# Altium project HuaweiInverterMODBUS.PrjPcb
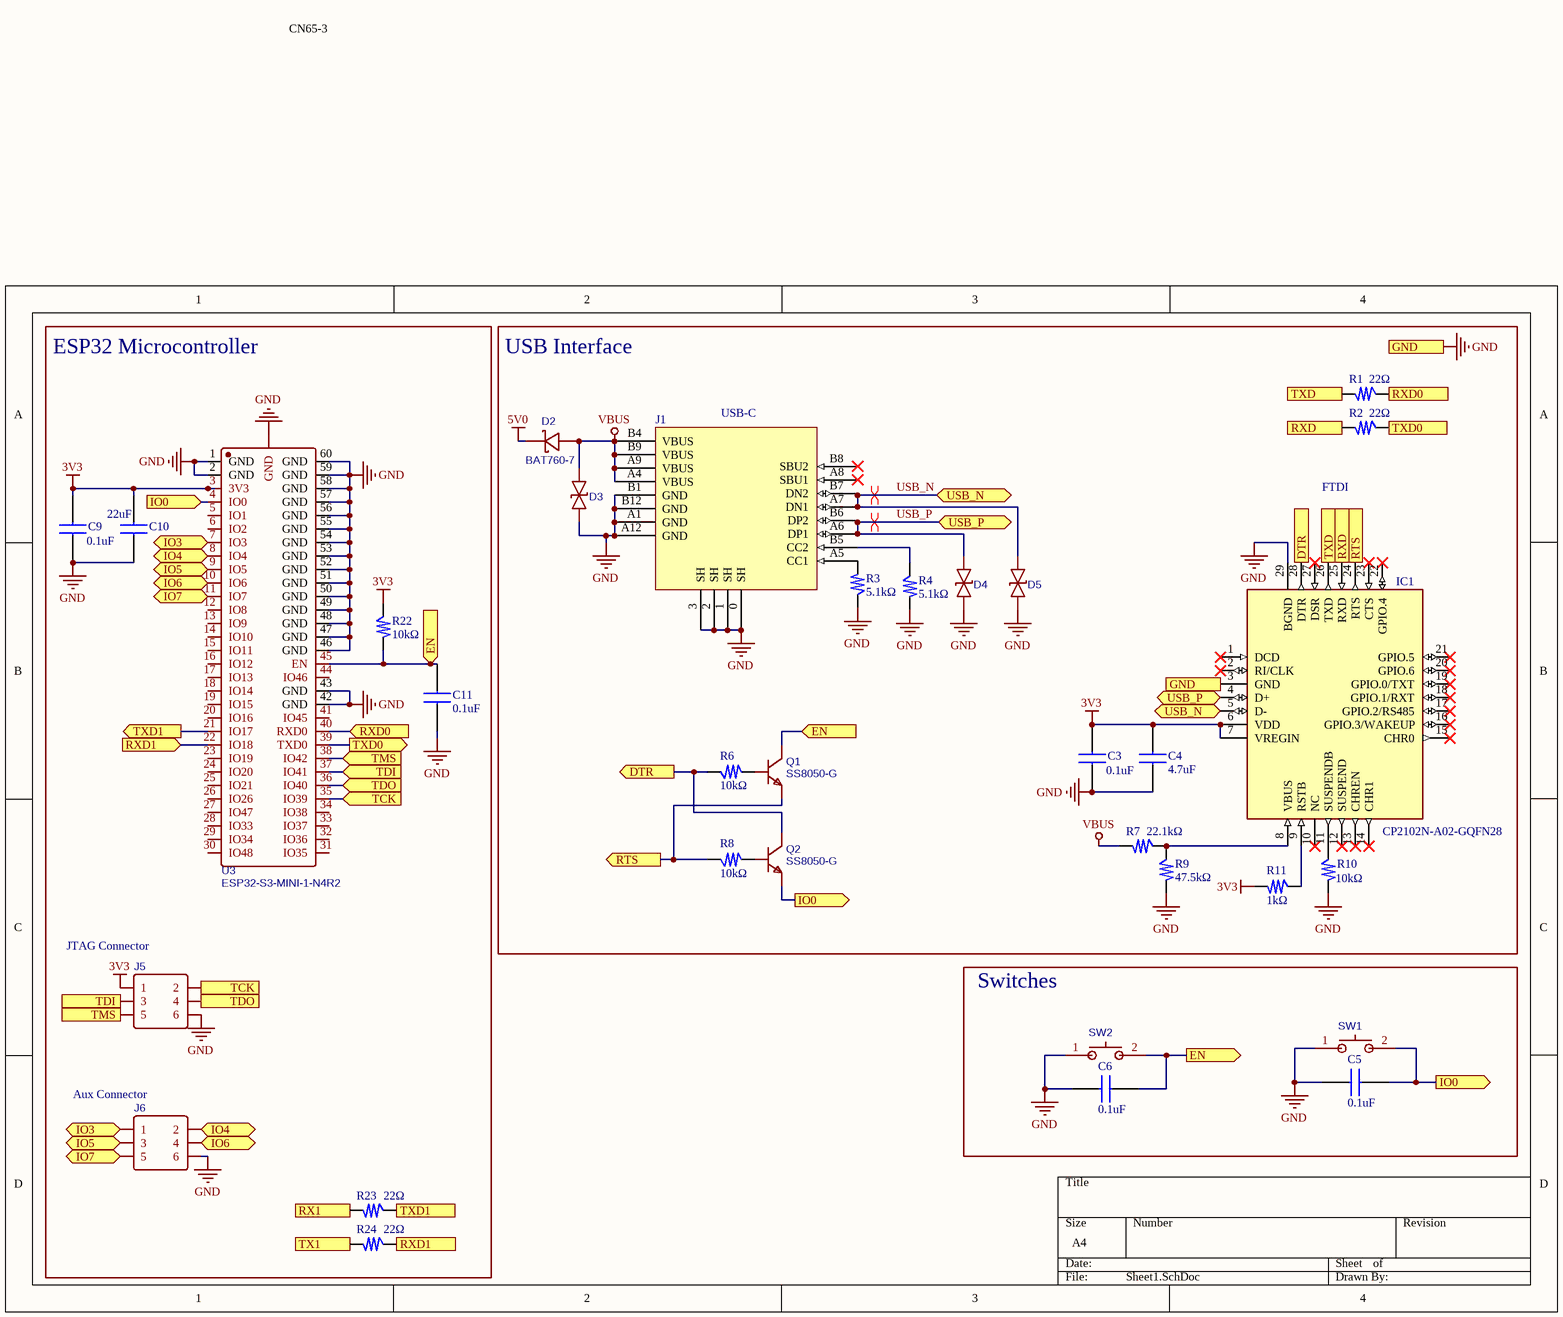
[diagram p0: Sheet1.SchDoc]
2 sheets, 67 parts. Net scope: flat (ports and power ports of the same name join across sheets).
Board file: HuaweiInverterMODBUS.PcbDoc
Sheets:
  Sheet1.SchDoc
  Sheet2.SchDoc

## Sheet Sheet1.SchDoc
size A4; SheetNumber: 1; SheetTotal: 2

### Parts
C3  value 0.1uF  [CAP0608N]  (hidden comment: CAP_0603_0.1UF_20%_50V_X5R)
C4  value 4.7uF  [CAP0608N]  (hidden comment: CAP_0603_4.7UF_20%_10V_X5R)
C5  value 0.1uF  [CAP0608N]  (hidden comment: CAP_0603_0.1UF_20%_50V_X5R)
C6  value 0.1uF  [CAP0608N]  (hidden comment: CAP_0603_0.1UF_20%_50V_X5R)
C9  value 0.1uF  [CAP0608N]  (hidden comment: CAP_0603_0.1UF_20%_50V_X5R)
C10  value 22uF  [CAP0608N]  (hidden comment: CAP0603_22UF_20%_10V_X5R)
C11  value 0.1uF  [CAP0608N]  (hidden comment: CAP_0603_0.1UF_20%_50V_X5R)
D2  BAT760-7  [SOD-323_L1.8-W1.3-LS2.5-RD]
D3  LESD5D5.0CT1G  [SOD-523_L1.2-W0.8-LS1.6-BI]  (value not drawn)
D4  LESD5D5.0CT1G  [SOD-523_L1.2-W0.8-LS1.6-BI]  (value not drawn)
D5  LESD5D5.0CT1G  [SOD-523_L1.2-W0.8-LS1.6-BI]  (value not drawn)
IC1  CP2102N-A02-GQFN28  [QFN50P500X500X80-29N-D]
J1  USB-C  [USBC_SMD_TH]
J5  Header-Male-2.54_2x3  [HDR-TH_6P-P2.54-V-M-R2-C3-S2.54-1]  (value not drawn)
J6  Header-Male-2.54_2x3  [HDR-TH_6P-P2.54-V-M-R2-C3-S2.54-1]  (value not drawn)
Q1  SS8050-G  [SOT-23-3_L2.9-W1.6-P1.90-LS2.8-BR]
Q2  SS8050-G  [SOT-23-3_L2.9-W1.6-P1.90-LS2.8-BR]
R1  value 22Ω  [RES0603N]  (hidden comment: RES_0603_22OHM_0.1W)
R2  value 22Ω  [RES0603N]  (hidden comment: RES_0603_22OHM_0.1W)
R3  value 5.1kΩ  [RES0603N]  (hidden comment: RES_0603_5.1KOHM_0.1W)
R4  value 5.1kΩ  [RES0603N]  (hidden comment: RES_0603_5.1KOHM_0.1W)
R6  value 10kΩ  [RES0603N]  (hidden comment: RES_0603_10KOHM_0.1W)
R7  value 22.1kΩ  [RES0603N]  (hidden comment: RES_0603_22.1KOHM_0.1W)
R8  value 10kΩ  [RES0603N]  (hidden comment: RES_0603_10KOHM_0.1W)
R9  value 47.5kΩ  [RES0603N]  (hidden comment: RES_0603_47.5KOHM_0.1W)
R10  value 10kΩ  [RES0603N]  (hidden comment: RES_0603_10KOHM_0.1W)
R11  value 1kΩ  [RES0603N]  (hidden comment: RES_0603_1KOHM_0.1W)
R22  value 10kΩ  [RES0603N]  (hidden comment: RES_0603_10KOHM_0.1W)
R23  value 22Ω  [RES0603N]  (hidden comment: RES_0603_22OHM_0.1W)
R24  value 22Ω  [RES0603N]  (hidden comment: RES_0603_22OHM_0.1W)
SW1  HX TS342A2P WZ 250GF  [SW-SMD_L4.0-W2.9-LS5.0]  (value not drawn)
SW2  HX TS342A2P WZ 250GF  [SW-SMD_L4.0-W2.9-LS5.0]  (value not drawn)
U3  ESP32-S3-MINI-1-N4R2  [BULETM-SMD_ESP32-S3-MINI-1-N8]

### Blocks framed on the sheet
ESP32 Microcontroller: C9-C11 J5 J6 R22-R24 U3
USB Interface: C3 C4 D2-D5 IC1 J1 Q1 Q2 R1-R4 R6-R11
Switches: C5 C6 SW1 SW2

### Ports
DTR (out), EN (in), EN (out), GND, IO0 (in), IO0 (out), IO3 (bidir), IO4 (bidir), IO5 (bidir), IO6 (bidir), IO7 (bidir), RTS (out), RX1 (out), RXD0 (in), RXD0 (out), RXD1 (in), RXD1 (out), RXD (in), RXD (out), TCK (in), TCK (out), TDI (in), TDI (out), TDO (in), TDO (out), TMS (in), TMS (out), TX1 (in), TXD0 (in), TXD0 (out), TXD1 (in), TXD1 (out), TXD (out), USB_N (bidir), USB_P (bidir)

### Nets
3V3: C3.2 C4.2 C9.2 C10.2 IC1.6(VDD) IC1.7(VREGIN) J5.1 R11.1 R22.2 U3.3(3V3)
5V0: D2.1
GND: C3.1 C4.1 C5.1 C6.1 C9.1 C10.1 C11.2 D3.1 D4.2 D5.2 IC1.3(GND) IC1.29(BGND) J1.0(SH) J1.1(SH) J1.2(SH) J1.3(SH) J1.A1(GND) J1.A12(GND) J1.B1(GND) J1.B12(GND) J5.6 J6.6 R3.2 R4.1 R9.1 R10.1 SW1.1 SW2.1 U3.1(GND) U3.2(GND) U3.42(GND) U3.43(GND) U3.46(GND) U3.47(GND) U3.48(GND) U3.49(GND) U3.50(GND) U3.51(GND) U3.52(GND) U3.53(GND) U3.54(GND) U3.55(GND) U3.56(GND) U3.57(GND) U3.58(GND) U3.59(GND) U3.60(GND) U3.GND ; port GND
VBUS: D2.2 D3.2 J1.A4(VBUS) J1.A9(VBUS) J1.B4(VBUS) J1.B9(VBUS) R7.1
USB_N: D5.1 IC1.5(D-) J1.A7(DN1) J1.B7(DN2) ; port USB_N
USB_P: D4.1 IC1.4(D+) J1.A6(DP1) J1.B6(DP2) ; port USB_P
NetC5_2: C5.2 Q2.2(E) SW1.2 U3.4(IO0) ; port IO0
NetC6_2: C6.2 C11.1 Q1.3(C) R22.1 SW2.2 U3.45(EN) ; port EN
NetIC1_8: IC1.8(VBUS) R7.2 R9.2
NetIC1_9: IC1.9(RSTB) R11.2
NetIC1_11: IC1.11(SUSPENDB) R10.2
NetIC1_24: IC1.24(RTS) Q1.2(E) R8.2 ; port RTS
NetIC1_25: IC1.25(RXD) R2.1 ; port RXD
NetIC1_26: IC1.26(TXD) R1.1 ; port TXD
NetIC1_28: IC1.28(DTR) Q2.3(C) R6.2 ; port DTR
NetJ1_A5: J1.A5(CC1) R3.1
NetJ1_B5: J1.B5(CC2) R4.2
NetJ5_2: J5.2 U3.35(IO39) ; port TCK
NetJ5_3: J5.3 U3.37(IO41) ; port TDI
NetJ5_4: J5.4 U3.36(IO40) ; port TDO
NetJ5_5: J5.5 U3.38(IO42) ; port TMS
NetJ6_1: J6.1 U3.7(IO3) ; port IO3
NetJ6_2: J6.2 U3.8(IO4) ; port IO4
NetJ6_3: J6.3 U3.9(IO5) ; port IO5
NetJ6_4: J6.4 U3.10(IO6) ; port IO6
NetJ6_5: J6.5 U3.11(IO7) ; port IO7
NetQ1_1: Q1.1(B) R6.1
NetQ2_1: Q2.1(B) R8.1
NetR1_2: R1.2 U3.40(RXD0) ; port RXD0
NetR2_2: R2.2 U3.39(TXD0) ; port TXD0
NetR12_1: R23.1 ; port RX1
NetR23_2: R23.2 U3.21(IO17) ; port TXD1
NetR24_1: R24.1 ; port TX1
NetR24_2: R24.2 U3.22(IO18) ; port RXD1

Not connected (* = marked no-connect by the designer): IC1 1(DCD)* 2(RI/CLK)* 10(NC)* 12(SUSPEND)* 13(CHREN)* 14(CHR1)* 15(CHR0)* 16(GPIO.3/WAKEUP)* 17(GPIO.2/RS485)* 18(GPIO.1/RXT)* 19(GPIO.0/TXT)* 20(GPIO.6)* 21(GPIO.5)* 22(GPIO.4)* 23(CTS)* 27(DSR)*; J1 A8(SBU1)* B8(SBU2)*; U3 5(IO1) 6(IO2) 12(IO8) 13(IO9) 14(IO10) 15(IO11) 16(IO12) 17(IO13) 18(IO14) 19(IO15) 20(IO16) 23(IO19) 24(IO20) 25(IO21) 26(IO26) 27(IO47) 28(IO33) 29(IO34) 30(IO48) 31(IO35) 32(IO36) 33(IO37) 34(IO38) 41(IO45) 44(IO46)

### Layout directives
differential pair: USB_N, USB_P

### Notes on the sheet
- CN65-3
- FTDI
- (near J5) JTAG Connector
- (near J6) Aux Connector

### Library data of the parts
C3 C5 C6 C9 C11 = CAP_0603_0.1UF_20%_50V_X5R: Condensadores de cerámica multicapa (MLCC- SMD/SMT) 0.1uF+/-20% 50V X5R 0603; Manufacturer_Name: SAMSUNG; Manufacturer_Part_Number: CL10A226MP8NUNE; Geometry.Height: 1.05mm; Mouser Part Number: 187-CL10A226MP8NUNE; Mouser Price/Stock: https://www.mouser.co.uk/ProductDetail/Samsung-Electro-Mechanics/CL10A226MP8NUNE?qs=gRKWieUq2Hb5O0PTfRKzDQ%3D%3D; Datasheet Link: https://datasheet.datasheetarchive.com/originals/distributors/Datasheets-DGA10/2407063.pdf
C4 = CAP_0603_4.7UF_20%_10V_X5R: Condensadores de cerámica multicapa (MLCC- SMD/SMT) 4.7uF+/-20% 10V X5R 0603; Manufacturer_Name: SAMSUNG; Manufacturer_Part_Number: CL10A226MP8NUNE; Geometry.Height: 1.05mm; Mouser Part Number: 187-CL10A226MP8NUNE; Mouser Price/Stock: https://www.mouser.co.uk/ProductDetail/Samsung-Electro-Mechanics/CL10A226MP8NUNE?qs=gRKWieUq2Hb5O0PTfRKzDQ%3D%3D; Datasheet Link: https://datasheet.datasheetarchive.com/originals/distributors/Datasheets-DGA10/2407063.pdf
C10 = CL10A226MP8NUNE: Condensadores de cerámica multicapa (MLCC- SMD/SMT) 22uF+/-20% 10V X5R 0603; Manufacturer_Name: SAMSUNG; Geometry.Height: 1.05mm; Mouser Part Number: 187-CL10A226MP8NUNE; Mouser Price/Stock: https://www.mouser.co.uk/ProductDetail/Samsung-Electro-Mechanics/CL10A226MP8NUNE?qs=gRKWieUq2Hb5O0PTfRKzDQ%3D%3D; Manufacturer_Part_Number: CL10A226MP8NUNE; Datasheet Link: https://datasheet.datasheetarchive.com/originals/distributors/Datasheets-DGA10/2407063.pdf
D2 = BAT760-7: 30V 550mV@1A 1A SOD-323 Schottky Barrier Diodes (SBD) ROHS; Manufacturer: Diodes Incorporated; Contributor: LCSC; Supplier: LCSC; MPN: BAT760-7; Supplier Part: C124187; JLCPCB Part Class: Extended Part; spicePre: D; spiceSymbolName: BAT760-7
D3-D5 = LESD5D5.0CT1G: 5.6V 18.6V 5V Bi-Directional SOD-523 ESD Protection Devices ROHS; Manufacturer: LRC; Contributor: LCSC; Supplier: LCSC; Supplier Part: C383211; MPN: LESD5D5.0CT1G; JLCPCB Part Class: Extended Part; spicePre: D; spiceSymbolName: LESD5D5.0CT1G
IC1 = CP2102N-A02-GQFN28: CI de interfaz USB USBXpress - USB to UART Bridge QFN28; Manufacturer_Name: Silicon Labs; Datasheet Link: https://componentsearchengine.com/Datasheets/2/CP2102N-A02-GQFN28.pdf; Height: 0.8mm; Manufacturer_Part_Number: CP2102N-A02-GQFN28; Mouser Part Number: 634-CP2102NA02GQFN28; Mouser Price/Stock: https://www.mouser.co.uk/ProductDetail/Silicon-Labs/CP2102N-A02-GQFN28?qs=u16ybLDytRaSBkSkyjYFiA%3D%3D; Arrow Part Number: CP2102N-A02-GQFN28; Arrow Price/Stock: https://www.arrow.com/en/products/cp2102n-a02-gqfn28/silicon-labs?region=europe
J1 = USB-C 16PIN CONNECTOR: 3A Surface Mount 16P Female -25℃~+85℃ Type-C SMD USB Connectors ROHS; Manufacturer: Dealon; MPN: USB-TYPE-C-018
J5 J6 = Header-Male-2.54_2x3: Pin Header Straight 6P 2.54mm Black Plugin,P=2.54mm Pin Headers ROHS; Manufacturer: BOOMELE; MPN: 2.54-2*3P针; Supplier: LCSC; Supplier Part: C65114; JLCPCB Part Class: Extended Part; spicePre: J; spiceSymbolName: Header-Male-2.54_2x3
Q1 Q2 = SS8050-G: 25V 300mW 120@100mA,1V 1.5A NPN SOT-23 Bipolar Transistors - BJT ROHS; Manufacturer: Jiangsu Changjing Electronics Technology; Contributor: LCSC; Supplier: LCSC; MPN: SS8050-G; Supplier Part: C164886; JLCPCB Part Class: Extended Part; spicePre: Q; spiceSymbolName: SS8050-G
R1 R2 R23 R24 = RES_0603_22OHM_0.1W: Res Thick Film 0603 22 Ohm 1% 0.1W(1/10W) +/-100ppm/C Epoxy Pad SMD T/R; Manufacturer_Name: YAGEO; Manufacturer_Part_Number: RC0603FR-071KL; MPN: RT0603FRE075K1L; Geometry.Height: 0.55mm; Mouser Part Number: 603-RC0603FR-071KL; Mouser Price/Stock: https://www.mouser.co.uk/ProductDetail/YAGEO/RC0603FR-071KL?qs=VU8sRB4EgwApHsk4rF%2F3zg%3D%3D; Datasheet Link: https://www.yageo.com/upload/media/product/productsearch/datasheet/rchip/PYu-RC_Group_51_RoHS_L_12.pdf; Manufacturer: Yageo
R3 R4 = RES_0603_5.1KOHM_0.1W: Res Thick Film 0603 5.1K Ohm 1% 0.1W(1/10W) +/-100ppm/C Epoxy Pad SMD T/R; Manufacturer_Name: YAGEO; Manufacturer_Part_Number: RC0603FR-071KL; MPN: RT0603FRE075K1L; Geometry.Height: 0.55mm; Mouser Part Number: 603-RC0603FR-071KL; Mouser Price/Stock: https://www.mouser.co.uk/ProductDetail/YAGEO/RC0603FR-071KL?qs=VU8sRB4EgwApHsk4rF%2F3zg%3D%3D; Datasheet Link: https://www.yageo.com/upload/media/product/productsearch/datasheet/rchip/PYu-RC_Group_51_RoHS_L_12.pdf; Manufacturer: Yageo
R6 R8 R10 R22 = RES_0603_10KOHM_0.1W: Res Thick Film 0603 10K Ohm 1% 0.1W(1/10W) +/-100ppm/C Epoxy Pad SMD T/R; Manufacturer_Name: YAGEO; Manufacturer_Part_Number: RC0603FR-071KL; MPN: RT0603FRE075K1L; Geometry.Height: 0.55mm; Mouser Part Number: 603-RC0603FR-071KL; Mouser Price/Stock: https://www.mouser.co.uk/ProductDetail/YAGEO/RC0603FR-071KL?qs=VU8sRB4EgwApHsk4rF%2F3zg%3D%3D; Datasheet Link: https://www.yageo.com/upload/media/product/productsearch/datasheet/rchip/PYu-RC_Group_51_RoHS_L_12.pdf; Manufacturer: Yageo
R7 = RES_0603_22.1KOHM_0.1W: Res Thick Film 0603 22.1K Ohm 1% 0.1W(1/10W) +/-100ppm/C Epoxy Pad SMD T/R; Manufacturer_Name: YAGEO; Manufacturer_Part_Number: RC0603FR-071KL; MPN: RT0603FRE075K1L; Geometry.Height: 0.55mm; Mouser Part Number: 603-RC0603FR-071KL; Mouser Price/Stock: https://www.mouser.co.uk/ProductDetail/YAGEO/RC0603FR-071KL?qs=VU8sRB4EgwApHsk4rF%2F3zg%3D%3D; Datasheet Link: https://www.yageo.com/upload/media/product/productsearch/datasheet/rchip/PYu-RC_Group_51_RoHS_L_12.pdf; Manufacturer: Yageo
R9 = RES_0603_47.5KOHM_0.1W: Res Thick Film 0603 47.5K Ohm 1% 0.1W(1/10W) +/-100ppm/C Epoxy Pad SMD T/R; Manufacturer_Name: YAGEO; Manufacturer_Part_Number: RC0603FR-071KL; MPN: RT0603FRE075K1L; Geometry.Height: 0.55mm; Mouser Part Number: 603-RC0603FR-071KL; Mouser Price/Stock: https://www.mouser.co.uk/ProductDetail/YAGEO/RC0603FR-071KL?qs=VU8sRB4EgwApHsk4rF%2F3zg%3D%3D; Datasheet Link: https://www.yageo.com/upload/media/product/productsearch/datasheet/rchip/PYu-RC_Group_51_RoHS_L_12.pdf; Manufacturer: Yageo
R11 = RES_0603_1KOHM_0.1W: Res Thick Film 0603 1K Ohm 1% 0.1W(1/10W) +/-100ppm/C Epoxy Pad SMD T/R; Manufacturer_Name: YAGEO; Manufacturer_Part_Number: RC0603FR-071KL; Geometry.Height: 0.55mm; Mouser Part Number: 603-RC0603FR-071KL; Mouser Price/Stock: https://www.mouser.co.uk/ProductDetail/YAGEO/RC0603FR-071KL?qs=VU8sRB4EgwApHsk4rF%2F3zg%3D%3D; Datasheet Link: https://www.yageo.com/upload/media/product/productsearch/datasheet/rchip/PYu-RC_Group_51_RoHS_L_12.pdf; MPN: RC0603FR-071KL; Manufacturer: Yageo
SW1 SW2 = HX TS342A2P WZ 250GF: SMD Tactile Switches ROHS; Manufacturer: Hanxia; Contributor: lcsc; Supplier: LCSC; Supplier Part: C5143624; MPN: HX TS342A2P WZ 250gf; JLCPCB Part Class: Extended Part; spicePre: S; spiceSymbolName: HX TS342A2P WZ 250GF
U3 = ESP32-S3-MINI-1-N4R2: ESP32-S3 Mini SMD WiFi Modules ROHS; Manufacturer: ESPRESSIF; Contributor: lcsc; Supplier: LCSC; Supplier Part: C3013941; MPN: ESP32-S3-MINI-1-N4R2; JLCPCB Part Class: Extended Part; spicePre: U; spiceSymbolName: ESP32-S3-MINI-1-N4R2

## Sheet Sheet2.SchDoc
size A4; SheetNumber: 2; SheetTotal: 2
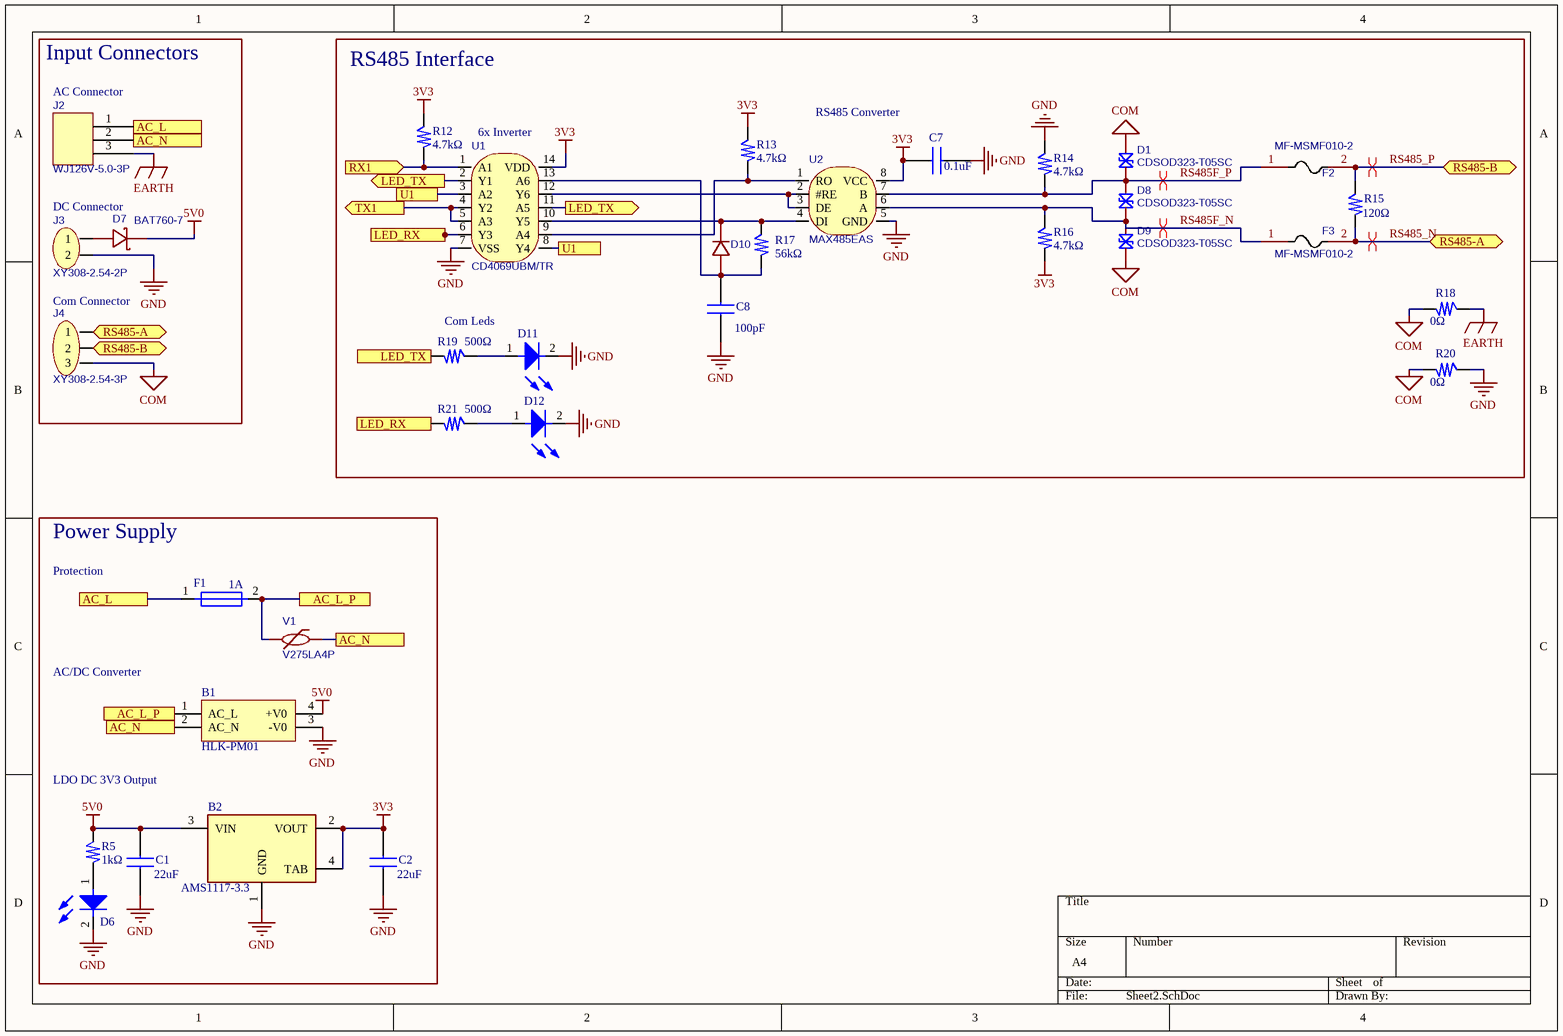
[diagram p1: Sheet2.SchDoc]

### Parts
B1  HLK-PM01  [HLKPM01]
B2  AMS1117-3.3  [SOT229P700X180-4N]
C1  value 22uF  [CAP0608N]  (hidden comment: CL10A226MP8NUNE)
C2  value 22uF  [CAP0608N]  (hidden comment: CL10A226MP8NUNE)
C7  value 0.1uF  [CAP0608N]  (hidden comment: CAP_0603_0.1UF_20%_50V_X5R)
C8  value 100pF  [CAP0608N]  (hidden comment: CAP_0603_100pF_5%_50V_C0G)
D1  CDSOD323-T05SC  [SOD-323_L1.8-W1.3-LS2.5-RD]
D6  0603_LED_GREEN_1.8V  [LED0603]  (value not drawn)
D7  BAT760-7  [SOD-323_L1.8-W1.3-LS2.5-RD]
D8  CDSOD323-T05SC  [SOD-323_L1.8-W1.3-LS2.5-RD]
D9  CDSOD323-T05SC  [SOD-323_L1.8-W1.3-LS2.5-RD]
D10  1N4148W T4  [SOD-123_L2.8-W1.8-LS3.7-RD]  (value not drawn)
D11  0603_LED_RED_1.9V  [LED0603]  (value not drawn)
D12  0603_LED_GREEN_1.8V  [LED0603]  (value not drawn)
F1  value 1A  [FUSE_TH_3x10]  (hidden comment: FUSE_TH_1A_GLASS)
F2  MF-MSMF010-2  [F1812]
F3  MF-MSMF010-2  [F1812]
J2  WJ126V-5.0-3P  [CONN-TH_3P-P5.00_WJ126V-5.0-3P]
J3  XY308-2.54-2P  [CONN-TH_XY308-2.54-2P]
J4  XY308-2.54-3P  [CONN-TH_XY308-2.54-3P]
R5  value 1kΩ  [RES0603N]  (hidden comment: RES_0603_1KOHM_0.1W)
R12  value 4.7kΩ  [RES0603N]  (hidden comment: RES_0603_4.7KOHM_0.1W)
R13  value 4.7kΩ  [RES0603N]  (hidden comment: RES_0603_4.7KOHM_0.1W)
R14  value 4.7kΩ  [RES0603N]  (hidden comment: RES_0603_4.7KOHM_0.1W)
R15  value 120Ω  [RES0603N]  (hidden comment: RES_0603_120OHM_0.1W)
R16  value 4.7kΩ  [RES0603N]  (hidden comment: RES_0603_4.7KOHM_0.1W)
R17  value 56kΩ  [RES0603N]  (hidden comment: RES_0603_56KOHM_0.1W)
R18  value 0Ω  [RES0603N]  (hidden comment: RES_0603_0OHM_0.1W)
R19  value 500Ω  [RES0603N]  (hidden comment: RES_0603_500OHM_0.1W)
R20  value 0Ω  [RES0603N]  (hidden comment: RES_0603_0OHM_0.1W)
R21  value 500Ω  [RES0603N]  (hidden comment: RES_0603_500OHM_0.1W)
U1  CD4069UBM/TR  [SOIC-14_L8.7-W3.9-P1.27-LS6.0-BL]
U2  MAX485EAS  [SOP-8_L5.0-W4.0-P1.27-LS6.0-BL]
V1  V275LA4P  [RES-TH_L9.0-W5.6-P6.00-D1.0-S3.50]

### Blocks framed on the sheet
Input Connectors: D7 J2-J4
RS485 Interface: C7 C8 D1 D8-D12 F2 F3 R12-R21 U1 U2
Power Supply: B1 B2 C1 C2 D6 F1 R5 V1

### Ports
AC_L, AC_L_P, AC_N, LED_RX (in), LED_RX (out), LED_TX (in), LED_TX (out), RS485-A (bidir), RS485-B (bidir), RX1 (in), TX1 (out), U1

### Nets
3V3: B2.2(VOUT) B2.4(TAB) C2.2 C7.2 R12.2 R13.2 R16.1 U1.14(VDD) U2.8(VCC)
5V0: B1.4(+V0) B2.3(VIN) C1.2 D7.1 R5.2
COM: D1.1(K) D9.2(A) J4.3 R18.1 R20.1
EARTH: J2.3 R18.2
GND: B1.3(-V0) B2.1(GND) C1.1 C2.1 C7.1 C8.2 D6.2(K) D11.2(K) D12.2(K) J3.2 R14.2 R20.2 U1.7(VSS) U2.5(GND)
RS485_N: F3.2 J4.1 R15.1 ; port RS485-A
RS485_P: F2.2 J4.2 R15.2 ; port RS485-B
RS485F_N: D8.2(A) D9.1(K) F3.1 R16.2 U2.6(A)
RS485F_P: D1.2(A) D8.1(K) F2.1 R14.1 U2.7(B)
NetB1_1: B1.1(AC_L) F1.2 V1.2 ; port AC_L_P
NetB1_2: B1.2(AC_N) J2.2 V1.1 ; port AC_N
NetC8_1: C8.1 D10.2(A) R17.1 U1.13(A6)
NetD6_1: D6.1(A) R5.1
NetD7_2: D7.2 J3.1
NetD10_1: D10.1(K) R17.2 U1.10(Y5) U2.4(DI)
NetD11_1: D11.1(A) R19.2
NetD12_1: D12.1(A) R21.2
NetF1_1: F1.1 J2.1 ; port AC_L
NetR12_1: R12.1 U1.1(A1) ; port RX1
NetR13_1: R13.1 U1.9(A4) U2.1(RO)
NetR19_1: R19.1 U1.2(Y1) U1.11(A5) ; port LED_TX
NetR21_1: R21.1 U1.6(Y3) ; port LED_RX
NetR24_1: U1.4(Y2) U1.5(A3) ; port TX1
NetU1_3: U1.3(A2) U1.8(Y4) ; port U1
NetU1_12: U1.12(Y6) U2.2(#RE) U2.3(DE)

### Layout directives
differential pair: RS485_N, RS485_P, RS485F_N, RS485F_P

### Notes on the sheet
- (near J2) AC Connector
- RS485 Converter
- (near U1) 6x Inverter
- DC Connector
- (near J4) Com Connector
- Com Leds
- Protection
- AC/DC Converter
- LDO DC 3V3 Output

### Library data of the parts
B1 = HLK-PM01: 3W Ultra-compact power module / In: 100-240Vac / Out: 5Vdc 0.6A; Manufacturer_Name: Hi-Link; Geometry.Height: 15mm; Manufacturer_Part_Number: HLK-PM01; Datasheet Link: https://datasheet.lcsc.com/szlcsc/1906201102_HI-LINK-HLK-PM03_C209904.pdf
B2 = AMS1117-3.3: 1A 3.3VDC LOW DROPOUT VOLTAGE REGULATOR, SOT-223; Manufacturer_Name: Advanced Monolithic Systems; Manufacturer_Part_Number: ams1117-3.3v; Geometry.Height: 1.8mm; Datasheet Link: http://www.advanced-monolithic.com/pdf/ds1117.pdf
C1 C2 = CL10A226MP8NUNE: as C10 on sheet Sheet1; Mouser Part Number: 187-CL10A226MP8NUNE; Mouser Price/Stock: https://www.mouser.co.uk/ProductDetail/Samsung-Electro-Mechanics/CL10A226MP8NUNE?qs=gRKWieUq2Hb5O0PTfRKzDQ%3D%3D; Manufacturer_Part_Number: CL10A226MP8NUNE; Datasheet Link: https://datasheet.datasheetarchive.com/originals/distributors/Datasheets-DGA10/2407063.pdf
C7 = CAP_0603_0.1UF_20%_50V_X5R: as C3 on sheet Sheet1; Mouser Part Number: 187-CL10A226MP8NUNE; Mouser Price/Stock: https://www.mouser.co.uk/ProductDetail/Samsung-Electro-Mechanics/CL10A226MP8NUNE?qs=gRKWieUq2Hb5O0PTfRKzDQ%3D%3D; Datasheet Link: https://datasheet.datasheetarchive.com/originals/distributors/Datasheets-DGA10/2407063.pdf
C8 = CAP_0603_100pF_5%_50V_C0G: Condensadores de cerámica multicapa (MLCC- SMD/SMT) 0.1uF+/-5% 50V C0G 0603; Manufacturer_Name: SAMSUNG; Manufacturer_Part_Number: CL10A226MP8NUNE; Geometry.Height: 1.05mm; Mouser Part Number: 187-CL10A226MP8NUNE; Mouser Price/Stock: https://www.mouser.co.uk/ProductDetail/Samsung-Electro-Mechanics/CL10A226MP8NUNE?qs=gRKWieUq2Hb5O0PTfRKzDQ%3D%3D; Datasheet Link: https://datasheet.datasheetarchive.com/originals/distributors/Datasheets-DGA10/2407063.pdf
D1 D8 D9 = CDSOD323-T05SC: 14.5V 6V 5V SOD-323 TVS ROHS; Manufacturer: BOURNS; Contributor: lcsc; Supplier: LCSC; Supplier Part: C840636; MPN: CDSOD323-T05SC; JLCPCB Part Class: Extended Part; spicePre: D; spiceSymbolName: CDSOD323-T05SC
D6 D12 = MHT192JGCT: 0603 Green Led; Geometry.Height: 0.8mm
D7 = BAT760-7: as D2 on sheet Sheet1; Supplier: LCSC; MPN: BAT760-7; Supplier Part: C124187; JLCPCB Part Class: Extended Part; spicePre: D; spiceSymbolName: BAT760-7
D10 = 1N4148W T4: Diode 100V 500mW Single 1.25V@150mA 4ns 150mA SOD-123 Switching Diode ROHS; Manufacturer: CJ; Supplier: LCSC; MPN: 1N4148W; Supplier Part: C2099; JLCPCB Part Class: Extended Part; spicePre: D; spiceSymbolName: 1N4148W T4
D11 = MHT192CRCT: 0603 Red Led; Geometry.Height: 0.8mm
F1 = FUSE_TH_10x3_GLASS: Fuse 1A AC250V; MPN: 31FC1A250V; Manufacturer: Hongda
F2 F3 = MF-MSMF010-2: Resettable Fuses 60V 100mA 40A 300mA 1812 Resettable Fuses ROHS; Manufacturer: BOURNS; Supplier: LCSC; MPN: MF-MSMF010-2; Supplier Part: C12430; JLCPCB Part Class: Extended Part; spicePre: F; spiceSymbolName: MF-MSMF010-2
J2 = WJ126V-5.0-3P: 1x3P 18A -40℃~+105℃ 250V Green 14~26 Straight pin 5mm 2.5 1 3 Plugin,P=5mm Screw terminal ROHS; Manufacturer: KANGNEX; Supplier: LCSC; MPN: WJ126V-5.0-3P; Supplier Part: C8401; JLCPCB Part Class: Extended Part; spicePre: P; spiceSymbolName: WJ126V-5.0-3P
J3 = XY308-2.54-2P: 1x2P 6A 150V Green 18~26 Straight pin 2.54mm 1 1 2 Plugin,P=2.54mm Screw terminal ROHS; Manufacturer: XINLAIYA; Contributor: LCSC; Supplier: LCSC; Supplier Part: C557685; MPN: XY308-2.54-2P; JLCPCB Part Class: Extended Part; spicePre: U; spiceSymbolName: XY308-2.54-2P
J4 = XY308-2.54-3P: Screw Terminal 1x3P 6A 150V Green 18~26 Straight pin 2.54mm 1 1 3 Plugin,P=2.54mm ROHS; Manufacturer: XINLAIYA; Contributor: LCSC; Supplier: LCSC; Supplier Part: C557686; MPN: XY308-2.54-3P; JLCPCB Part Class: Extended Part; spicePre: U; spiceSymbolName: XY308-2.54-3P
R5 = RES_0603_1KOHM_0.1W: as R11 on sheet Sheet1; Mouser Part Number: 603-RC0603FR-071KL; Mouser Price/Stock: https://www.mouser.co.uk/ProductDetail/YAGEO/RC0603FR-071KL?qs=VU8sRB4EgwApHsk4rF%2F3zg%3D%3D; Datasheet Link: https://www.yageo.com/upload/media/product/productsearch/datasheet/rchip/PYu-RC_Group_51_RoHS_L_12.pdf; MPN: RC0603FR-071KL; Manufacturer: Yageo
R12-R14 R16 = RES_0603_4.7KOHM_0.1W: Res Thick Film 0603 4.7K Ohm 1% 0.1W(1/10W) +/-100ppm/C Epoxy Pad SMD T/R; Manufacturer_Name: YAGEO; Manufacturer_Part_Number: RC0603FR-071KL; MPN: RT0603FRE075K1L; Geometry.Height: 0.55mm; Mouser Part Number: 603-RC0603FR-071KL; Mouser Price/Stock: https://www.mouser.co.uk/ProductDetail/YAGEO/RC0603FR-071KL?qs=VU8sRB4EgwApHsk4rF%2F3zg%3D%3D; Datasheet Link: https://www.yageo.com/upload/media/product/productsearch/datasheet/rchip/PYu-RC_Group_51_RoHS_L_12.pdf; Manufacturer: Yageo
R15 = RES_0603_120OHM_0.1W: Res Thick Film 0603 120 Ohm 1% 0.1W(1/10W) +/-100ppm/C Epoxy Pad SMD T/R; Manufacturer_Name: YAGEO; Manufacturer_Part_Number: RC0603FR-071KL; MPN: RT0603FRE075K1L; Geometry.Height: 0.55mm; Mouser Part Number: 603-RC0603FR-071KL; Mouser Price/Stock: https://www.mouser.co.uk/ProductDetail/YAGEO/RC0603FR-071KL?qs=VU8sRB4EgwApHsk4rF%2F3zg%3D%3D; Datasheet Link: https://www.yageo.com/upload/media/product/productsearch/datasheet/rchip/PYu-RC_Group_51_RoHS_L_12.pdf; Manufacturer: Yageo
R17 = RES_0603_56KOHM_0.1W: Res Thick Film 0603 56K Ohm 1% 0.1W(1/10W) +/-100ppm/C Epoxy Pad SMD T/R; Manufacturer_Name: YAGEO; Manufacturer_Part_Number: RC0603FR-071KL; MPN: RT0603FRE075K1L; Geometry.Height: 0.55mm; Mouser Part Number: 603-RC0603FR-071KL; Mouser Price/Stock: https://www.mouser.co.uk/ProductDetail/YAGEO/RC0603FR-071KL?qs=VU8sRB4EgwApHsk4rF%2F3zg%3D%3D; Datasheet Link: https://www.yageo.com/upload/media/product/productsearch/datasheet/rchip/PYu-RC_Group_51_RoHS_L_12.pdf; Manufacturer: Yageo
R18 R20 = RES_0603_0HM_0.1W_1: Res Thick Film 0603 0 Ohm 1% 0.1W(1/10W) +/-100ppm/C Epoxy Pad SMD T/R; Manufacturer_Name: YAGEO; Manufacturer_Part_Number: RC0603FR-071KL; MPN: RT0603FRE075K1L; Geometry.Height: 0.55mm; Mouser Part Number: 603-RC0603FR-071KL; Mouser Price/Stock: https://www.mouser.co.uk/ProductDetail/YAGEO/RC0603FR-071KL?qs=VU8sRB4EgwApHsk4rF%2F3zg%3D%3D; Datasheet Link: https://www.yageo.com/upload/media/product/productsearch/datasheet/rchip/PYu-RC_Group_51_RoHS_L_12.pdf; Manufacturer: Yageo
R19 R21 = RES_0603_500OHM_0.1W: Res Thick Film 0603 500 Ohm 1% 0.1W(1/10W) +/-100ppm/C Epoxy Pad SMD T/R; Manufacturer_Name: YAGEO; Manufacturer_Part_Number: RC0603FR-071KL; MPN: RT0603FRE075K1L; Geometry.Height: 0.55mm; Mouser Part Number: 603-RC0603FR-071KL; Mouser Price/Stock: https://www.mouser.co.uk/ProductDetail/YAGEO/RC0603FR-071KL?qs=VU8sRB4EgwApHsk4rF%2F3zg%3D%3D; Datasheet Link: https://www.yageo.com/upload/media/product/productsearch/datasheet/rchip/PYu-RC_Group_51_RoHS_L_12.pdf; Manufacturer: Yageo
U1 = CD4069UBM/TR: SOIC-14 Inverters ROHS; Manufacturer: HGSEMI; Contributor: LCSC; Supplier: LCSC; Supplier Part: C194330; MPN: CD4069UBM/TR; JLCPCB Part Class: Extended Part; spicePre: U; spiceSymbolName: CD4069UBM/TR
U2 = MAX485EAS: SOP-8 RS-485/RS-422 ICs ROHS; Manufacturer: UMW; MPN: MAX485ESA; Contributor: LCSC; Supplier: LCSC; Supplier Part: C668206; JLCPCB Part Class: Extended Part; spicePre: U; spiceSymbolName: MAX485EAS
V1 = V275LA4P: Plugin Varistors 275Vrms  ROHS; Manufacturer: Littelfuse; Contributor: LCSC; Supplier: LCSC; Supplier Part: C129558; MPN: V275LA4P; JLCPCB Part Class: Extended Part; spicePre: R; spiceSymbolName: V275LA4P

## Nets that join several sheets
3V3: Sheet1 (10 pins), Sheet2 (9 pins)
5V0: Sheet1 (D2.1), Sheet2 (5 pins)
GND: Sheet1 (48 pins), Sheet2 (14 pins)
NetR12_1: Sheet1 (R23.1), Sheet2 (R12.1 U1.1)
NetR24_1: Sheet1 (R24.1), Sheet2 (U1.4 U1.5)